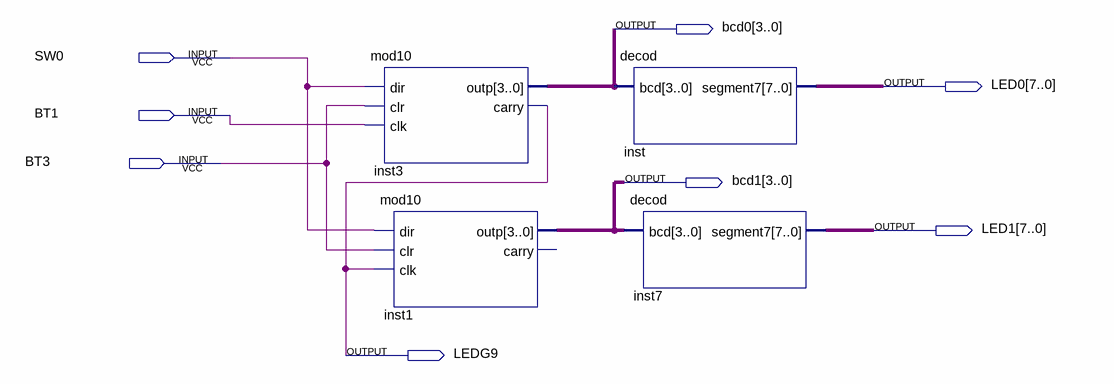
[diagram p0: schematic sheet]
// Quartus schematic cw3.bdf as structural Verilog: 4 symbols, 8 pins
module cw3 (
  input  SW0,
  input  BT1,
  input  BT3,
  output [3:0] bcd0,
  output [7:0] LED0,
  output [3:0] bcd1,
  output [7:0] LED1,
  output LEDG9
);

  mod10 inst3 (.dir(SW0), .clr(BT3), .clk(BT1), .outp(bcd0), .carry(LEDG9));
  mod10 inst1 (.dir(SW0), .clr(BT3), .clk(LEDG9), .outp(bcd1));  // open: carry
  decod inst (.bcd(bcd0), .segment7(LED0));
  decod inst7 (.bcd(bcd1), .segment7(LED1));
endmodule
